# Altium schematic sheet USB_IO_main.SchDoc
size A4
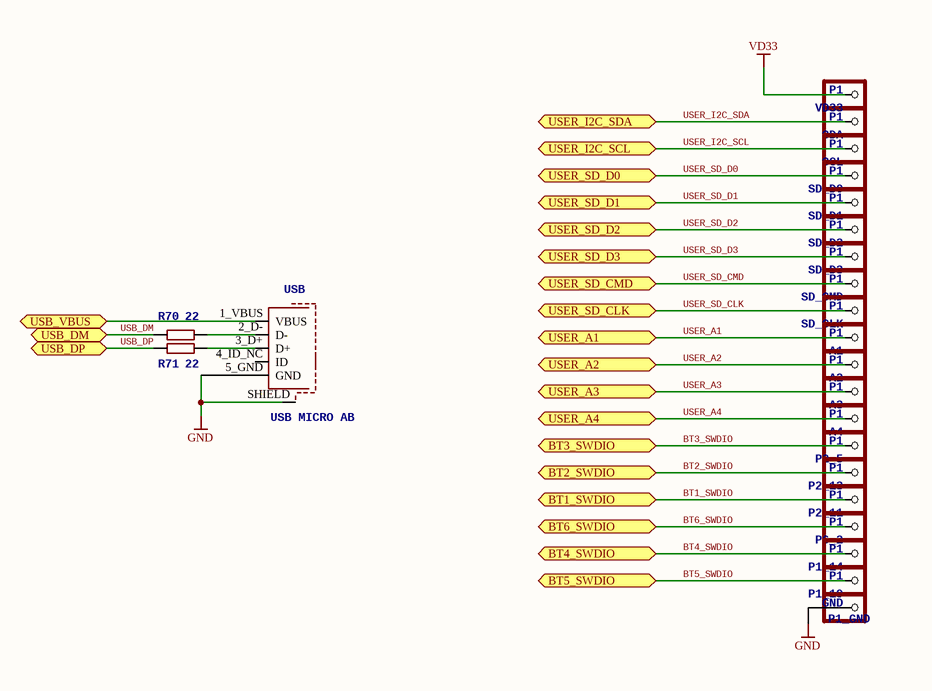
[diagram p0: USB_IO_main.SchDoc]

## Parts
A1  P1  [PCB_MEDIUM_RECT_PAD]  (no BOM)
A2  P1  [PCB_MEDIUM_RECT_PAD]  (no BOM)
A3  P1  [PCB_MEDIUM_RECT_PAD]  (no BOM)
A4  P1  [PCB_MEDIUM_RECT_PAD]  (no BOM)
P1_14  P1  [PCB_MEDIUM_RECT_PAD]  (no BOM)
P1_19  P1  [PCB_MEDIUM_RECT_PAD]  (no BOM)
P1_GND  GND  [PCB_MEDIUM_RECT_PAD]  (no BOM)
P2_5  P1  [PCB_MEDIUM_RECT_PAD]  (no BOM)
P2_11  P1  [PCB_MEDIUM_RECT_PAD]  (no BOM)
P2_13  P1  [PCB_MEDIUM_RECT_PAD]  (no BOM)
P6_2  P1  [PCB_MEDIUM_RECT_PAD]  (no BOM)
R70  22  [0402]
R71  22  [0402]
SCL  P1  [PCB_MEDIUM_RECT_PAD]  (no BOM)
SD_CLK  P1  [PCB_MEDIUM_RECT_PAD]  (no BOM)
SD_CMD  P1  [PCB_MEDIUM_RECT_PAD]  (no BOM)
SD_D0  P1  [PCB_MEDIUM_RECT_PAD]  (no BOM)
SD_D1  P1  [PCB_MEDIUM_RECT_PAD]  (no BOM)
SD_D2  P1  [PCB_MEDIUM_RECT_PAD]  (no BOM)
SD_D3  P1  [PCB_MEDIUM_RECT_PAD]  (no BOM)
SDA  P1  [PCB_MEDIUM_RECT_PAD]  (no BOM)
USB  USB MICRO AB  [USB_MICRO_SMD]
VD33  P1  [PCB_MEDIUM_RECT_PAD]  (no BOM)

## Ports
BT1_SWDIO, BT2_SWDIO, BT3_SWDIO, BT4_SWDIO, BT5_SWDIO, BT6_SWDIO, USB_DM, USB_DP, USB_VBUS, USER_A1, USER_A2, USER_A3, USER_A4, USER_I2C_SCL, USER_I2C_SDA, USER_SD_CLK, USER_SD_CMD, USER_SD_D0, USER_SD_D1, USER_SD_D2, USER_SD_D3

## Nets
GND: P1_GND.1 USB.5_GND(GND) USB.SHIELD
VD33: VD33.1
BT1_SWDIO: P2_11.1 ; port BT1_SWDIO
BT2_SWDIO: P2_13.1 ; port BT2_SWDIO
BT3_SWDIO: P2_5.1 ; port BT3_SWDIO
BT4_SWDIO: P1_14.1 ; port BT4_SWDIO
BT5_SWDIO: P1_19.1 ; port BT5_SWDIO
BT6_SWDIO: P6_2.1 ; port BT6_SWDIO
USB_DM: R70.2 ; port USB_DM
USB_DP: R71.2 ; port USB_DP
USB_VBUS: USB.1_VBUS(VBUS) ; port USB_VBUS
USER_A1: A1.1 ; port USER_A1
USER_A2: A2.1 ; port USER_A2
USER_A3: A3.1 ; port USER_A3
USER_A4: A4.1 ; port USER_A4
USER_I2C_SCL: SCL.1 ; port USER_I2C_SCL
USER_I2C_SDA: SDA.1 ; port USER_I2C_SDA
USER_SD_CLK: SD_CLK.1 ; port USER_SD_CLK
USER_SD_CMD: SD_CMD.1 ; port USER_SD_CMD
USER_SD_D0: SD_D0.1 ; port USER_SD_D0
USER_SD_D1: SD_D1.1 ; port USER_SD_D1
USER_SD_D2: SD_D2.1 ; port USER_SD_D2
USER_SD_D3: SD_D3.1 ; port USER_SD_D3
NetR70_1: R70.1 USB.2_D-(D-)
NetR71_1: R71.1 USB.3_D+(D+)

Not connected (* = marked no-connect by the designer): USB 4_ID_NC(ID)

## Library data of the parts
A1-A4 P1_14 P1_19 P1_GND P2_5 P2_11 P2_13 P6_2 SCL SD_CLK SD_CMD SD_D0-SD_D3 SDA VD33 = HEADER-1X1SMD_MEDIUM: <b>PIN HEADER</b>
R70 R71 = R-EU_0402: RESISTOR; SMD: Yes
USB = USB_MICROSMD: Micro USB right angle (AB) connector; USB: USB; SMD: Yes